# Altium schematic sheet USBC_DS1_DS2.SchDoc
size A3; SheetNumber: 1; SheetTotal: 4; SPICEModelCacheQHYZYIJX: <root> / <DocumentId>QHYZYIJX</DocumentId> / </root>
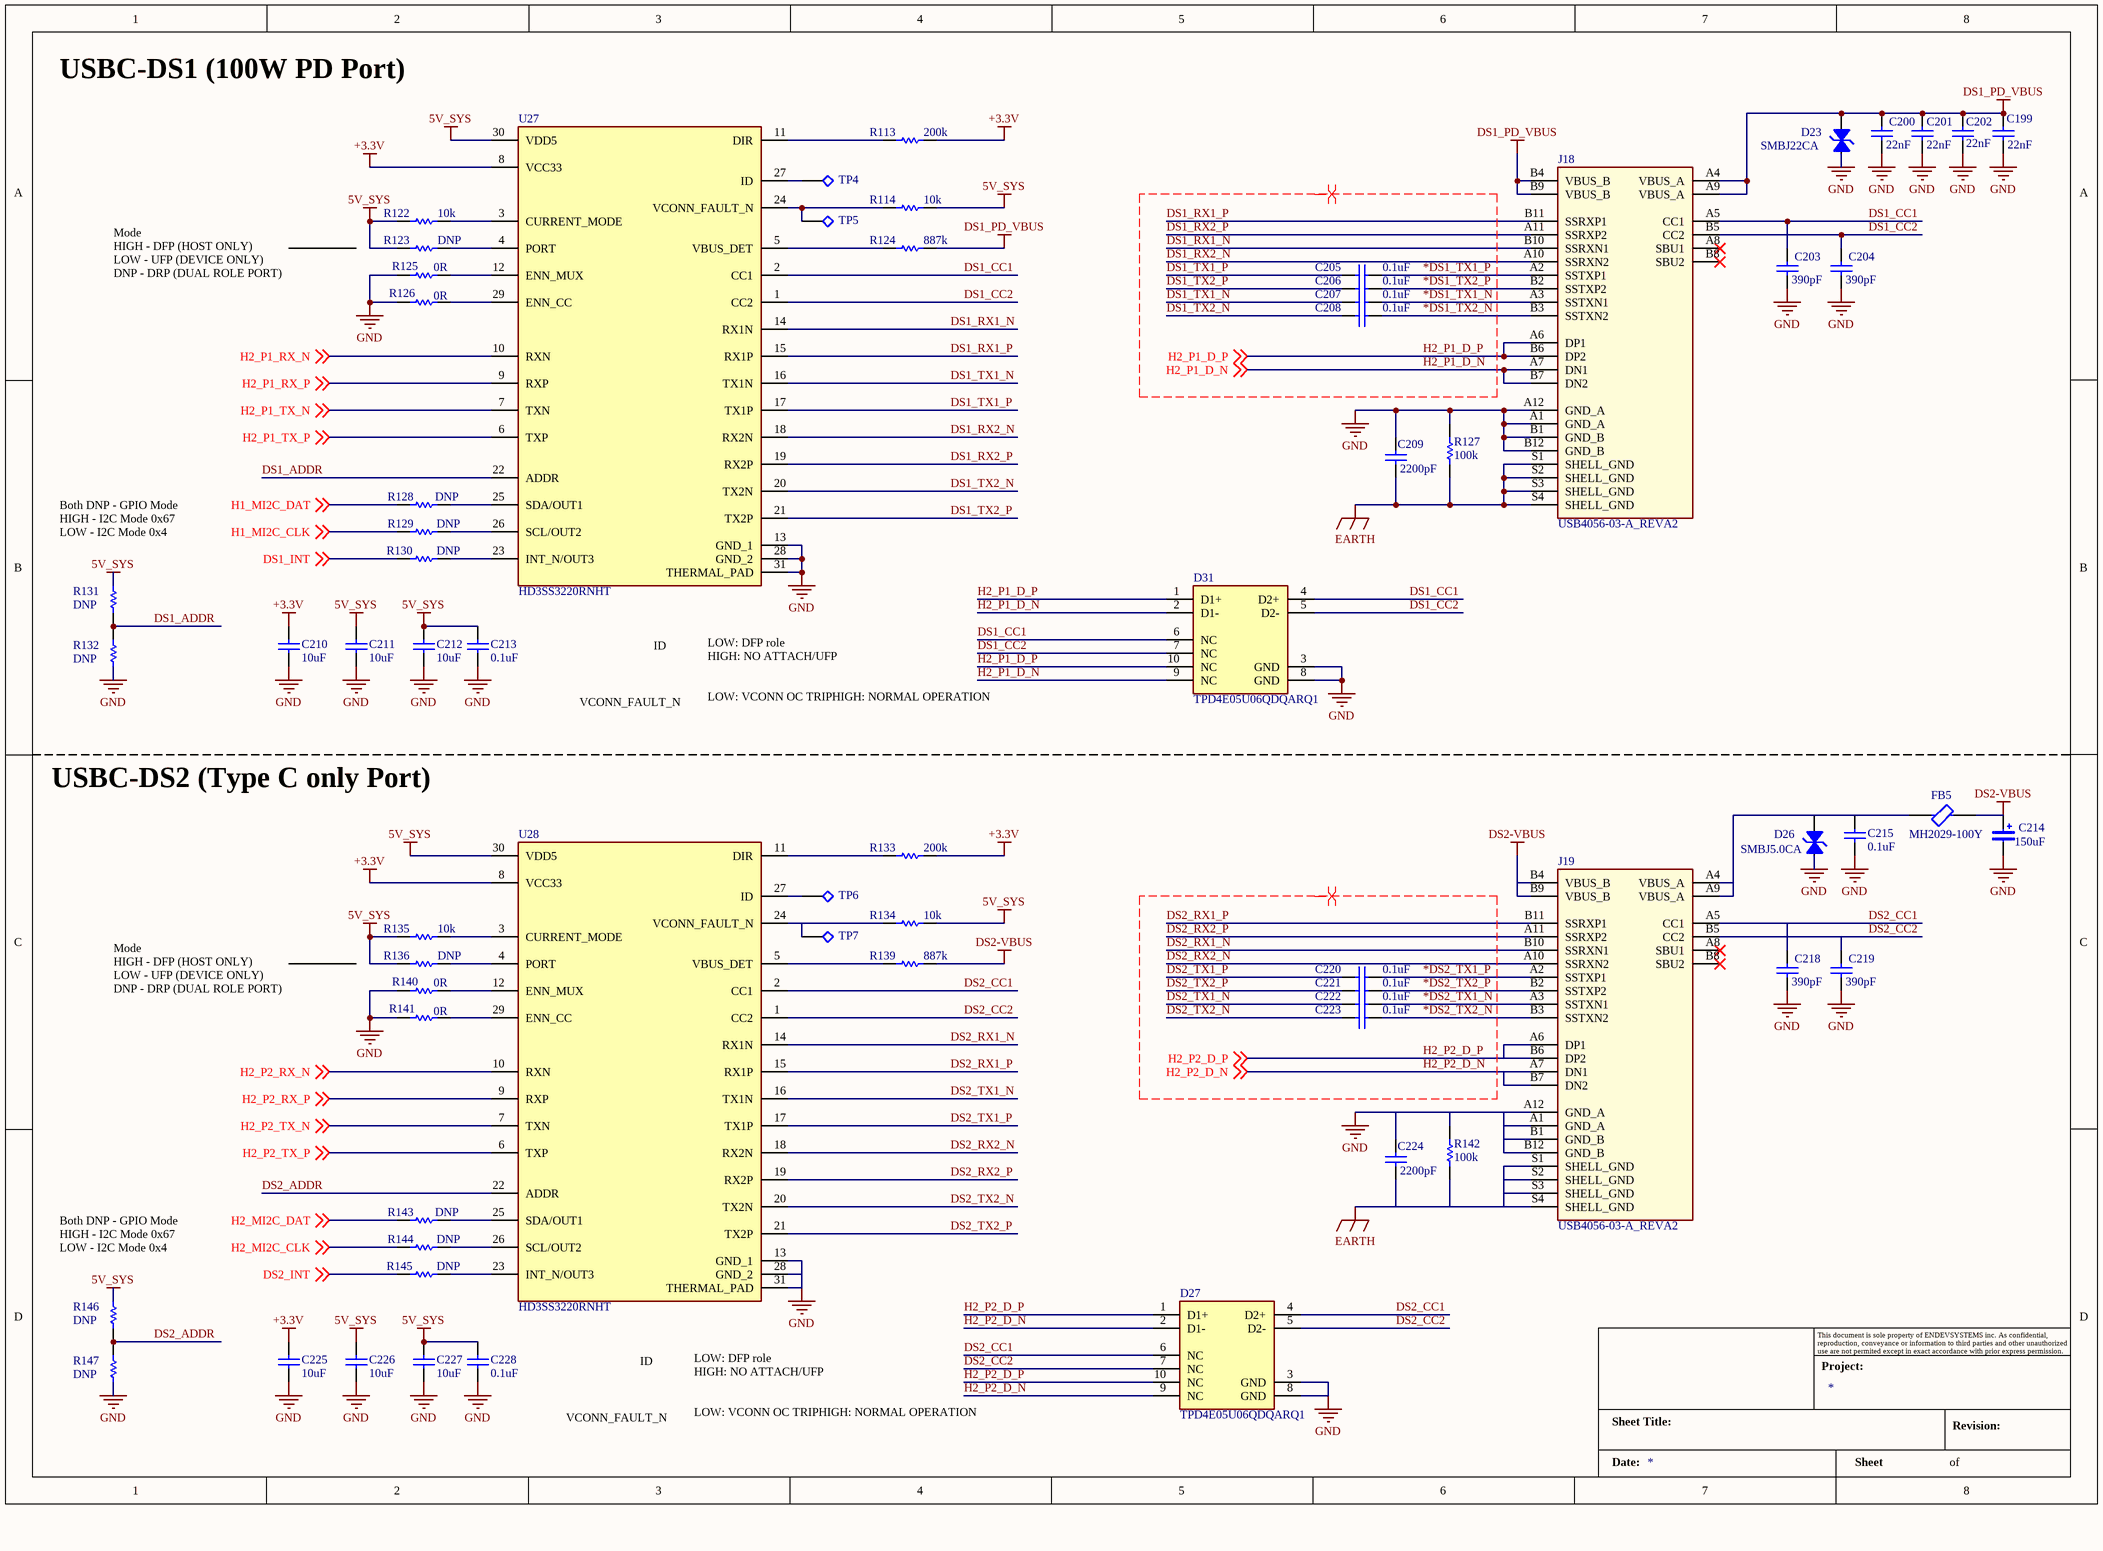
[diagram p0: USBC_DS1_DS2.SchDoc]

## Parts
?  Title_Block  (value not drawn)  (graphical)
C199  22nF  [C-0805/2012]
C200  22nF  [C-0805/2012]
C201  22nF  [C-0805/2012]
C202  22nF  [C-0805/2012]
C203  390pF  [C-0805/2012]
C204  390pF  [C-0805/2012]
C205  0.1uF  [CAP 1206/3216]
C206  0.1uF  [CAP 1206/3216]
C207  0.1uF  [CAP 1206/3216]
C208  0.1uF  [CAP 1206/3216]
C209  2200pF  [C-0603/1608]
C210  10uF  [CAP 1206/3216]
C211  10uF  [CAP 1206/3216]
C212  10uF  [CAP 1206/3216]
C213  0.1uF  [CAP 1206/3216]
C214  150uF  [CAP-TAN-2312]
C215  0.1uF  [CAP 1206/3216]
C218  390pF  [C-0805/2012]
C219  390pF  [C-0805/2012]
C220  0.1uF  [CAP 1206/3216]
C221  0.1uF  [CAP 1206/3216]
C222  0.1uF  [CAP 1206/3216]
C223  0.1uF  [CAP 1206/3216]
C224  2200pF  [C-0603/1608]
C225  10uF  [CAP 1206/3216]
C226  10uF  [CAP 1206/3216]
C227  10uF  [CAP 1206/3216]
C228  0.1uF  [CAP 1206/3216]
D23  SMBJ22CA  [DO-214AA\SMB]
D26  SMBJ5.0CA  [DO-214AA\SMB]
D27  TPD4E05U06QDQARQ1  [FP-DQA0010A-MFG]
D31  TPD4E05U06QDQARQ1  [FP-DQA0010A-MFG]
FB5  MH2029-100Y  [R-0805/2012]
J18  USB4056-03-A_REVA2  [GCT_USB4056-03-A_REVA2]
J19  USB4056-03-A_REVA2  [GCT_USB4056-03-A_REVA2]
R113  200k  [R-0402]
R114  10k  [R-0402]
R122  10k  [R-0402]
R123  DNP  [R-0402]
R124  887k  [R-0402]
R125  0R  [R-0402]
R126  0R  [R-0402]
R127  100k  [R-0603/1608]
R128  DNP  [R-0402]
R129  DNP  [R-0402]
R130  DNP  [R-0402]
R131  DNP  [R-0402]
R132  DNP  [R-0402]
R133  200k  [R-0402]
R134  10k  [R-0402]
R135  10k  [R-0402]
R136  DNP  [R-0402]
R139  887k  [R-0402]
R140  0R  [R-0402]
R141  0R  [R-0402]
R142  100k  [R-0603/1608]
R143  DNP  [R-0402]
R144  DNP  [R-0402]
R145  DNP  [R-0402]
R146  DNP  [R-0402]
R147  DNP  [R-0402]
TP4  Test Points  [Test Point TH Round H0.9,D1.6]  (value not drawn)
TP5  Test Points  [Test Point TH Round H0.9,D1.6]  (value not drawn)
TP6  Test Points  [Test Point TH Round H0.9,D1.6]  (value not drawn)
TP7  Test Points  [Test Point TH Round H0.9,D1.6]  (value not drawn)
U27  HD3SS3220RNHT  [QFN40P250X450X80-31N-D]
U28  HD3SS3220RNHT  [QFN40P250X450X80-31N-D]

## Nets
5V_SYS: C211.2 C212.2 C213.2 C226.2 C227.2 C228.2 R114.2 R122.1 R123.1 R131.2 R134.2 R135.1 R136.1 R146.2 U27.30(VDD5) U28.30(VDD5)
+3.3V: C210.2 C225.2 R113.2 R133.2 U27.8(VCC33) U28.8(VCC33)
DS1_PD_VBUS: C199.2 C200.2 C201.2 C202.2 D23.2 J18.A4(VBUS_A) J18.A9(VBUS_A) J18.B4(VBUS_B) J18.B9(VBUS_B) R124.1
DS2-VBUS: C214.+ FB5.2 J19.B4(VBUS_B) J19.B9(VBUS_B) R139.1
EARTH: C209.1 C224.1 J18.S1(SHELL_GND) J18.S2(SHELL_GND) J18.S3(SHELL_GND) J18.S4(SHELL_GND) J19.S1(SHELL_GND) J19.S2(SHELL_GND) J19.S3(SHELL_GND) J19.S4(SHELL_GND) R127.1 R142.1
GND: C199.1 C200.1 C201.1 C202.1 C203.1 C204.1 C209.2 C210.2 C211.2 C212.2 C213.2 C214.- C215.2 C218.1 C219.1 C224.2 C225.2 C226.2 C227.2 C228.2 D23.1 D26.1 D27.3(GND) D27.8(GND) D31.3(GND) D31.8(GND) J18.A1(GND_A) J18.A12(GND_A) J18.B1(GND_B) J18.B12(GND_B) J19.A1(GND_A) J19.A12(GND_A) J19.B1(GND_B) J19.B12(GND_B) R125.1 R126.1 R127.2 R132.1 R140.1 R141.1 R142.2 R147.1 U27.13(GND_1) U27.28(GND_2) U27.31(THERMAL_PAD) U28.13(GND_1) U28.28(GND_2) U28.31(THERMAL_PAD)
*DS1_TX1_N: C207.2 J18.A3(SSTXN1)
*DS1_TX1_P: C205.2 J18.A2(SSTXP1)
*DS1_TX2_N: C208.2 J18.B3(SSTXN2)
*DS1_TX2_P: C206.2 J18.B2(SSTXP2)
*DS2_TX1_N: C222.2 J19.A3(SSTXN1)
*DS2_TX1_P: C220.2 J19.A2(SSTXP1)
*DS2_TX2_N: C223.2 J19.B3(SSTXN2)
*DS2_TX2_P: C221.2 J19.B2(SSTXP2)
DS1_ADDR: R131.1 R132.2 U27.22(ADDR)
DS1_CC1: C203.2 D31.4(D2+) D31.6(NC) J18.A5(CC1) U27.2(CC1)
DS1_CC2: C204.2 D31.5(D2-) D31.7(NC) J18.B5(CC2) U27.1(CC2)
DS1_INT: R130.1 ; off-sheet DS1_INT
DS1_RX1_N: J18.B10(SSRXN1) U27.14(RX1N)
DS1_RX1_P: J18.B11(SSRXP1) U27.15(RX1P)
DS1_RX2_N: J18.A10(SSRXN2) U27.18(RX2N)
DS1_RX2_P: J18.A11(SSRXP2) U27.19(RX2P)
DS1_TX1_N: C207.2 U27.16(TX1N)
DS1_TX1_P: C205.2 U27.17(TX1P)
DS1_TX2_N: C208.2 U27.20(TX2N)
DS1_TX2_P: C206.2 U27.21(TX2P)
DS2_ADDR: R146.1 R147.2 U28.22(ADDR)
DS2_CC1: C218.2 D27.4(D2+) D27.6(NC) J19.A5(CC1) U28.2(CC1)
DS2_CC2: C219.2 D27.5(D2-) D27.7(NC) J19.B5(CC2) U28.1(CC2)
DS2_INT: R145.1 ; off-sheet DS2_INT
DS2_RX1_N: J19.B10(SSRXN1) U28.14(RX1N)
DS2_RX1_P: J19.B11(SSRXP1) U28.15(RX1P)
DS2_RX2_N: J19.A10(SSRXN2) U28.18(RX2N)
DS2_RX2_P: J19.A11(SSRXP2) U28.19(RX2P)
DS2_TX1_N: C222.2 U28.16(TX1N)
DS2_TX1_P: C220.2 U28.17(TX1P)
DS2_TX2_N: C223.2 U28.20(TX2N)
DS2_TX2_P: C221.2 U28.21(TX2P)
H1_MI2C_CLK: R129.1 ; off-sheet H1_MI2C_CLK
H1_MI2C_DAT: R128.1 ; off-sheet H1_MI2C_DAT
H2_MI2C_CLK: R144.1 ; off-sheet H2_MI2C_CLK
H2_MI2C_DAT: R143.1 ; off-sheet H2_MI2C_DAT
H2_P1_D_N: D31.2(D1-) D31.9(NC) J18.A7(DN1) J18.B7(DN2) ; off-sheet H2_P1_D_N
H2_P1_D_P: D31.1(D1+) D31.10(NC) J18.A6(DP1) J18.B6(DP2) ; off-sheet H2_P1_D_P
H2_P1_RX_N: U27.10(RXN) ; off-sheet H2_P1_RX_N
H2_P1_RX_P: U27.9(RXP) ; off-sheet H2_P1_RX_P
H2_P1_TX_N: U27.7(TXN) ; off-sheet H2_P1_TX_N
H2_P1_TX_P: U27.6(TXP) ; off-sheet H2_P1_TX_P
H2_P2_D_N: D27.2(D1-) D27.9(NC) J19.A7(DN1) J19.B7(DN2) ; off-sheet H2_P2_D_N
H2_P2_D_P: D27.1(D1+) D27.10(NC) J19.A6(DP1) J19.B6(DP2) ; off-sheet H2_P2_D_P
H2_P2_RX_N: U28.10(RXN) ; off-sheet H2_P2_RX_N
H2_P2_RX_P: U28.9(RXP) ; off-sheet H2_P2_RX_P
H2_P2_TX_N: U28.7(TXN) ; off-sheet H2_P2_TX_N
H2_P2_TX_P: U28.6(TXP) ; off-sheet H2_P2_TX_P
NetC215_2: C215.2 D26.2 FB5.1 J19.A4(VBUS_A) J19.A9(VBUS_A)
NetR113_1: R113.1 U27.11(DIR)
NetR114_1: R114.1 TP5.1 U27.24(VCONN_FAULT_N)
NetR122_2: R122.2 U27.3(CURRENT_MODE)
NetR123_2: R123.2 U27.4(PORT)
NetR124_2: R124.2 U27.5(VBUS_DET)
NetR125_2: R125.2 U27.12(ENN_MUX)
NetR126_2: R126.2 U27.29(ENN_CC)
NetR128_2: R128.2 U27.25(SDA/OUT1)
NetR129_2: R129.2 U27.26(SCL/OUT2)
NetR130_2: R130.2 U27.23(INT_N/OUT3)
NetR133_1: R133.1 U28.11(DIR)
NetR134_1: R134.1 TP7.1 U28.24(VCONN_FAULT_N)
NetR135_2: R135.2 U28.3(CURRENT_MODE)
NetR136_2: R136.2 U28.4(PORT)
NetR139_2: R139.2 U28.5(VBUS_DET)
NetR140_2: R140.2 U28.12(ENN_MUX)
NetR141_2: R141.2 U28.29(ENN_CC)
NetR143_2: R143.2 U28.25(SDA/OUT1)
NetR144_2: R144.2 U28.26(SCL/OUT2)
NetR145_2: R145.2 U28.23(INT_N/OUT3)
NetTP4_1: TP4.1 U27.27(ID)
NetTP6_1: TP6.1 U28.27(ID)

Not connected (* = marked no-connect by the designer): J18 A8(SBU1)* B8(SBU2)*; J19 A8(SBU1)* B8(SBU2)*

## Layout directives
differential pair; differential pair class Diff_90R: *DS1_TX1_N, *DS1_TX1_P, *DS1_TX2_N, *DS1_TX2_P, *DS2_TX1_N, *DS2_TX1_P, *DS2_TX2_N, *DS2_TX2_P, DS1_RX1_N, DS1_RX1_P, DS1_RX2_N, DS1_RX2_P, DS1_TX1_N, DS1_TX1_P, DS1_TX2_N, DS1_TX2_P, DS2_RX1_N, DS2_RX1_P, DS2_RX2_N, DS2_RX2_P, DS2_TX1_N, DS2_TX1_P, DS2_TX2_N, DS2_TX2_P, H2_P1_D_N, H2_P1_D_P, H2_P2_D_N, H2_P2_D_P

## Notes on the sheet
- USBC-DS1 (100W PD Port)
- Mode
  HIGH - DFP (HOST ONLY)
  LOW - UFP (DEVICE ONLY)
  DNP - DRP (DUAL ROLE PORT)
- (near R131) Both DNP - GPIO Mode
  HIGH - I2C Mode 0x67
  LOW - I2C Mode 0x4
- ID
- VCONN_FAULT_N
- LOW: DFP role
  HIGH: NO ATTACH/UFP
- LOW: VCONN OC TRIPHIGH: NORMAL OPERATION
- USBC-DS2 (Type C only Port)
- (near R146) Both DNP - GPIO Mode
  HIGH - I2C Mode 0x67
  LOW - I2C Mode 0x4
- (in symbol Title_Block) This document is sole property of ENDEVSYSTEMS inc. As confidential, reproduction, conveyance or information to third parties and other unauthorized use are not permited except in exact accordance with prior express permission.; Project:; Sheet Title:; Revision:; Date:; Sheet; of

## Library data of the parts
C199-C204 C209 C218 C219 C224 = Cap: Capacitor; Value: 0.1uF; Published: 8-Jun-2000; LatestRevisionDate: 17-Jul-2002; LatestRevisionNote: Re-released for DXP Platform.; PackageReference: RAD-0.3; Publisher: Altium Limited; PackageDescription: Radial Cap, Thru-Hole; 2 Leads; 0.3 in Pin Spacing
C205-C208 C210-C213 C215 C220-C223 C225-C228 = CAP 1206/3216: CAP CER 10UF 25V X5R 1206; Mfr. Part No.: C1206C106M3PACTU; Unit Price (USD): 0.28; Supplier Part No.: 399-8153-1-ND; Supplier: Digikey Electronics
C214 = Capacitor-Polar: CAP TANT 10UF 10% 16V 1206; Mfr. Part No.: F931C106KAAAJ6; Unit Price (USD): 0.67; Value: 10uF 16V; Supplier Part No.: 478-10723-1-ND; Supplier: Digikey Electronics
D23 D26 = ACPDQC3V3T-HF: TVS DIODE 3.3V 9.8V 0402C; Unit Price (USD): 0.41; Mfr. Part No.: ACPDQC3V3T-HF; Supplier Part No.: 641-1635-1-ND; Supplier: Digikey Electronics
D27 D31 = CMP-04985-000004-1: TVS DIODE 5.5V 14V 10USON; Manufacturer: Texas Instruments; Direction: Unidirectional; Standoff Height: 0mm; Description: 14V Clamp 2.5A (8/20µs) Ipp Tvs Diode Surface Mount 10-USON (2.5x1); Capacitance: 0.5pF; Number Of Channels: 4; Breakdown Voltage: 6.4V; Peak Pulse Power: 2.5W; Automotive Grade: Grade 1; Value: 0.5pF; Interface: USB,Ethernet,LVDS,Other; Peak Pulse Current: 2.5A; Operating Supply Voltage: 5.5V; Reverse Standoff Voltage: 5.5V; Package: DQA0010A; Temperature Range Low: -40°C; Temperature Range High: +125°C; Ambient Temperature Range Low: -40°C; Device Class L1: Circuit Protection; Clamping Voltage: 14V; Manufacturer Part Number: TPD4E05U06QDQARQ1; Device Class L2: ESD and Circuit Protection ICs; Octopart: https://octopart.com/tpd4e05u06qdqarq1-texas+instruments-48523459; Device Class L3: unset; Height: 0.55mm; Automotive: Yes; ComponentLink2Description: Datasheet; RoHS: TRUE; Ambient Temperature Range High: +125°C; Category: IC; Mouser Description: Automotive 4-Channel ESD Protection Solution for SuperSpeed (up to 5 Gbps) Interface 10-USON -40 to 125; Temperature: -40°C to +125°C; ComponentLink2URL: http://www.ti.com/lit/ds/symlink/tpd4e05u06-q1.pdf; Digikey Description: TVS DIODE 5.5V 14V 10USON; Lead Free: Yes
FB5 = 5f30dd21d616792df468990f7003faa: Chip Ferrite Bead Array, 1206, 50Ω @ 100MHz, 0.0016Ω, ±12.5Ω, 12A; Number of Lines: 1; DC Resistance (DCR): 1.6mR; Max Current Rating: 12A; Case Code (Metric): 3216; Package Quantity: 3000; Height: 0.051inch; RoHS Compliant: Yes; Case/Package: 1206; Mount: Surface Mount; Case Code (Imperial): 1206; Width: 0.063inch; Length: 0.126inch; Max Operating Temperature: 125°C; Ratings: AEC-Q200; Packaging: Tape and Reel; Min Operating Temperature: -55°C
J18 J19 = USB4056-03-A_REVA2: USB-C (USB TYPE-C) USB 3.2 Gen 2 (USB 3.1 Gen 2, Superspeed + (USB 3.1)) Receptacle Connector 24 Position Surface Mount, Right Angle; Through Hole; MF: Global Connector Technology; Package: None; Check_prices: https://www.snapeda.com/parts/USB4056-03-A/Global+Connector+Technology/view-part/?ref=eda; Value: *; Availability: In Stock; SnapEDA_Link: https://www.snapeda.com/parts/USB4056-03-A/Global+Connector+Technology/view-part/?ref=snap; MP: USB4056-03-A; Price: None
R113 R114 R122-R126 R128-R136 R139-R141 R143-R147 = Resistor: RES SMD 51 OHM 0.5% 1/16W 0402; Mfr. Part No.: ERA-2AED510X; Value: 51R; Unit Price (USD): 0.21; Supplier Part No.: P51DECT-ND; Supplier: Digikey Electronics
R127 R142 = Res1: Resistor; Value: 10K; Published: 8-Jun-2000; LatestRevisionDate: 17-Jul-2002; LatestRevisionNote: Re-released for DXP Platform.; PackageReference: AXIAL-0.3; Publisher: Altium Limited; PackageDescription: Axial Device, Thru-Hole; 2 Leads; 0.3 in Pin Spacing
U27 U28 = HD3SS3220RNHT: Integrated Circuit; Manufacturer_Name: Texas Instruments; Datasheet Link: http://www.ti.com/lit/gpn/HD3SS3220; Height: 0.8mm; Manufacturer_Part_Number: HD3SS3220RNHT; Mouser Part Number: 595-HD3SS3220RNHT; Mouser Price/Stock: https://www.mouser.co.uk/ProductDetail/Texas-Instruments/HD3SS3220RNHT?qs=8%2FmU9qzJpL9k3fo1z5Ctsg%3D%3D; Arrow Part Number: HD3SS3220RNHT; Arrow Price/Stock: https://www.arrow.com/en/products/hd3ss3220rnht/texas-instruments?region=nac
? = Title_Block: Date:: *; Project:: *